# Altium schematic sheet E1.SchDoc
size 420 x 297 mm; CheckedBy: Чистяков М. Г.; Author: Наумов И. К.; DocumentNumber: ИУ4.11.03.03.25.06.62.14.001 Э1; SheetNumber: 1; SheetTotal: 3; DocumentType: Схема электрическая структурная
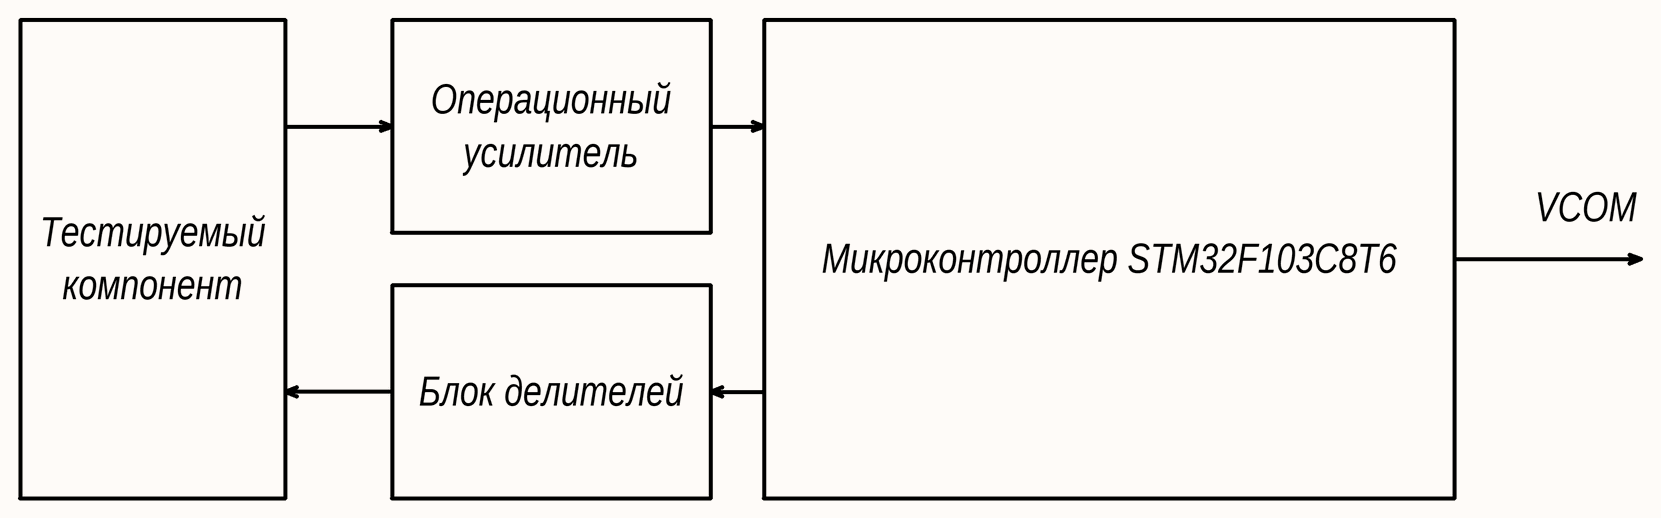
[diagram p0: E1.SchDoc]

## Notes on the sheet
- Операционный
- усилитель
- Тестируемый
- VCOM
- компонент
- Микроконтроллер STM32F103C8T6
- Блок делителей
- Перв. примен.
- Справ. №
- Подп. и дата
- Инв. № дубл.
- Взам. инв. №
- Разраб.
- Изм.
- Лист
- № докум.
- Подп.
- Дата
- Лит.
- Масса
- Масштаб
- Пров.
- Т.контр.
- Листов
- 1
- Инв. № подл.
- Утв.
- Н.контр.
- Кафедра ИУ4
- МГТУ им. Н. Э. Баумана
- 2.106-A3
- Копировал
- Формат А3
- Группа ИУ4-62Б